# Altium schematic sheet esquematico_placa_micro.SchDoc
size A4; SheetNumber: 1; SheetTotal: 1
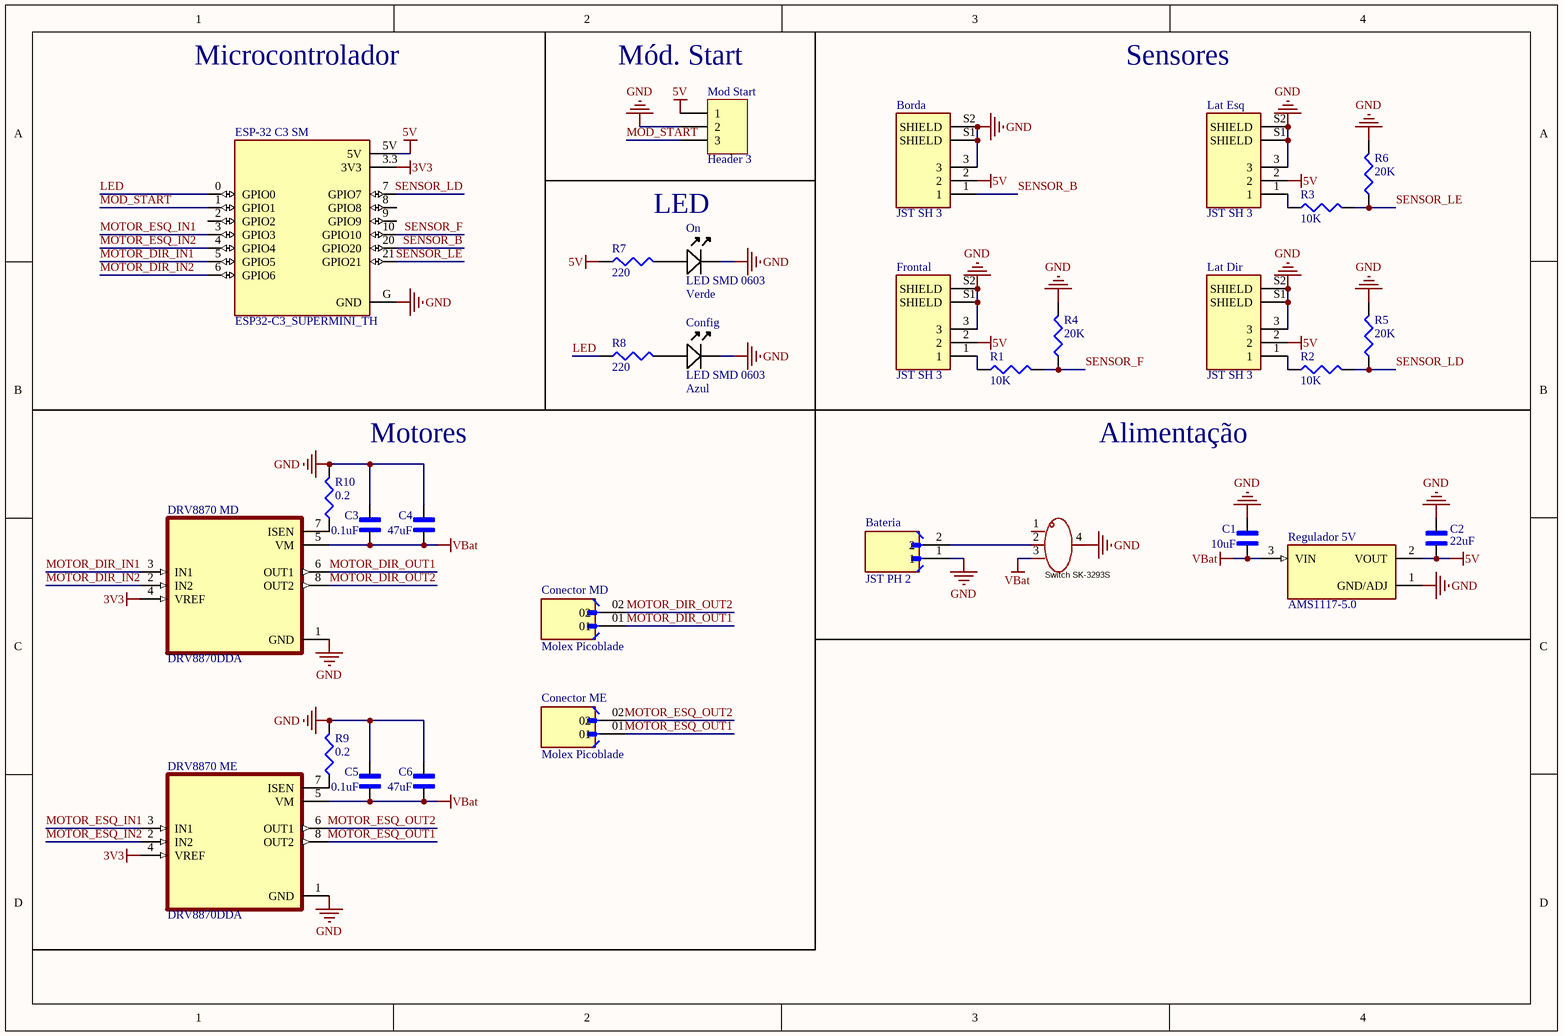
[diagram p0: esquematico_placa_micro.SchDoc]

## Parts
Bateria  JST PH 2  [JST_B2B-PH-K-S(LF)(SN)]
Borda  JST SH 3  [JST_BM03B-SRSS-TB(LF)(SN)]
C1  10uF  [CAPC0603]
C2  22uF  [CAPC0603]
C3  0.1uF  [CAPC0603]
C4  47uF  [CAPC0603]
C5  0.1uF  [CAPC0603]
C6  47uF  [CAPC0603]
Conector_MD  Molex Picoblade  [MOLEX_53047-0210]
Conector_ME  Molex Picoblade  [MOLEX_53047-0210]
Config  LED SMD 0603  Cor: Azul  [LED SMD 0603 Vermelho]
DRV8870_MD  DRV8870DDA  [VREG_LM5017MR/NOPB]
DRV8870_ME  DRV8870DDA  [VREG_LM5017MR/NOPB]
ESP-32_C3_SM  ESP32-C3_SUPERMINI_TH  [MODULE_ESP32-C3_SUPERMINI]
Frontal  JST SH 3  [JST_BM03B-SRSS-TB(LF)(SN)]
Lat_Dir  JST SH 3  [JST_BM03B-SRSS-TB(LF)(SN)]
Lat_Esq  JST SH 3  [JST_BM03B-SRSS-TB(LF)(SN)]
Mod_Start  Header 3  [MicroStart Start Module]
On  LED SMD 0603  Cor: Verde  [LED SMD 0603 Vermelho]
R1  value 10K  [Resistor SMD 0603]  (hidden comment: Resistor SMD)
R2  value 10K  [Resistor SMD 0603]  (hidden comment: Resistor SMD)
R3  value 10K  [Resistor SMD 0603]  (hidden comment: Resistor SMD)
R4  value 20K  [Resistor SMD 0603]  (hidden comment: Resistor SMD)
R5  value 20K  [Resistor SMD 0603]  (hidden comment: Resistor SMD)
R6  value 20K  [Resistor SMD 0603]  (hidden comment: Resistor SMD)
R7  value 220  [Resistor SMD 0603]  (hidden comment: Resistor SMD)
R8  value 220  [Resistor SMD 0603]  (hidden comment: Resistor SMD)
R9  value 0.2  [Resistor SMD 0603]  (hidden comment: Resistor SMD)
R10  value 0.2  [Resistor SMD 0603]  (hidden comment: Resistor SMD)
Regulador_5V  AMS1117-5.0  [AMS1117 5V]
Switch_SK-3293S  SK-3293S  [SW-SMD_SK-3293S]  (value not drawn)

## Nets
3V3: DRV8870_MD.4(VREF) DRV8870_ME.4(VREF) ESP-32_C3_SM.3.3(3V3)
5V: Borda.2 C2.1 ESP-32_C3_SM.5V Frontal.2 Lat_Dir.2 Lat_Esq.2 Mod_Start.1 R7.1 Regulador_5V.2(VOUT)
GND: Bateria.1 Borda.3 Borda.S1(SHIELD) Borda.S2(SHIELD) C1.2 C2.2 C3.2 C4.2 C5.2 C6.2 Config.K DRV8870_MD.1(GND) DRV8870_ME.1(GND) ESP-32_C3_SM.G(GND) Frontal.3 Frontal.S1(SHIELD) Frontal.S2(SHIELD) Lat_Dir.3 Lat_Dir.S1(SHIELD) Lat_Dir.S2(SHIELD) Lat_Esq.3 Lat_Esq.S1(SHIELD) Lat_Esq.S2(SHIELD) Mod_Start.2 On.K R4.2 R5.2 R6.2 R9.2 R10.2 Regulador_5V.1(GND/ADJ) Switch_SK-3293S.4(EH)
VBat: C1.1 C3.1 C4.1 C5.1 C6.1 DRV8870_MD.5(VM) DRV8870_ME.5(VM) Regulador_5V.3(VIN) Switch_SK-3293S.3
LED: ESP-32_C3_SM.0(GPIO0) R8.1
MOD_START: ESP-32_C3_SM.1(GPIO1) Mod_Start.3
MOTOR_DIR_IN1: DRV8870_MD.3(IN1) ESP-32_C3_SM.5(GPIO5)
MOTOR_DIR_IN2: DRV8870_MD.2(IN2) ESP-32_C3_SM.6(GPIO6)
MOTOR_DIR_OUT1: Conector_MD.01 DRV8870_MD.6(OUT1)
MOTOR_DIR_OUT2: Conector_MD.02 DRV8870_MD.8(OUT2)
MOTOR_ESQ_IN1: DRV8870_ME.3(IN1) ESP-32_C3_SM.3(GPIO3)
MOTOR_ESQ_IN2: DRV8870_ME.2(IN2) ESP-32_C3_SM.4(GPIO4)
MOTOR_ESQ_OUT1: Conector_ME.01 DRV8870_ME.8(OUT2)
MOTOR_ESQ_OUT2: Conector_ME.02 DRV8870_ME.6(OUT1)
SENSOR_B: Borda.1 ESP-32_C3_SM.20(GPIO20)
SENSOR_F: ESP-32_C3_SM.10(GPIO10) R1.2 R4.1
SENSOR_LD: ESP-32_C3_SM.7(GPIO7) R2.2 R5.1
SENSOR_LE: ESP-32_C3_SM.21(GPIO21) R3.2 R6.1
NetBateria_2: Bateria.2 Switch_SK-3293S.2
NetConfig_A: Config.A R8.2
NetDRV8870_MD_7: DRV8870_MD.7(ISEN) R10.1
NetDRV8870_ME_7: DRV8870_ME.7(ISEN) R9.1
NetFrontal_1: Frontal.1 R1.1
NetLat_Dir_1: Lat_Dir.1 R2.1
NetLat_Esq_1: Lat_Esq.1 R3.1
NetOn_A: On.A R7.2

Not connected (* = marked no-connect by the designer): ESP-32_C3_SM 2(GPIO2) 8(GPIO8) 9(GPIO9); Switch_SK-3293S 1

## Notes on the sheet
- Microcontrolador
- (near Mod_Start) Mód. Start
- Sensores
- LED
- Motores
- Alimentação

## Library data of the parts
Bateria = B2B-PH-K-S(LF)(SN): Connector Header Through Hole 2 position 0.079 (2.00mm); SnapEDA_Link: https://www.snapeda.com/parts/B2B-PH-K-S%20(LF)(SN)/JST/view-part/?ref=snap; Package: None; Value: *; MF: JST; MP: B2B-PH-K-S (LF)(SN); Check_prices: https://www.snapeda.com/parts/B2B-PH-K-S%20(LF)(SN)/JST/view-part/?ref=eda
Borda Frontal Lat_Dir Lat_Esq = BM03B-SRSS-TB(LF)(SN): Connector Header Surface Mount 3 position 0.039 (1.00mm); MF: JST Sales; SnapEDA_Link: https://www.snapeda.com/parts/BM03B-SRSS-TB(LF)(SN)/JST/view-part/?ref=snap; Package: None; Value: *; MP: BM03B-SRSS-TB(LF)(SN); Check_prices: https://www.snapeda.com/parts/BM03B-SRSS-TB(LF)(SN)/JST/view-part/?ref=eda
C1-C6 = Capacitor SMD: 0805 390 pF 50 V Â±5% Tolerance C0G SMT Multilayer Ceramic Capacitor; MF: Murata Electronics; MP: GRM2165C1H391JA01D; Price: 0.07 USD; SnapEDA_Link: https://www.snapeda.com/parts/GRM2165C1H391JA01D/Murata%2520Electronics%2520North%2520America/view-part/?ref=snap; Availability: Good; Package: 0805 Murata; Value: *
Conector_MD Conector_ME = 53047-0210: Picoblade Connector, 2 Circuit Single Row, Vertical Throughole PCB; MP: 0530470210; SnapEDA_Link: https://www.snapeda.com/parts/0530470210/Molex/view-part/?ref=snap; Package: None; Value: *; MF: Molex; Check_prices: https://www.snapeda.com/parts/0530470210/Molex/view-part/?ref=eda
Config On = LED SMD 0603: Diodo emissor de luz SMD 0603
ESP-32_C3_SM = ESP32-C3_SUPERMINI_TH: Super tiny ESP32-C3 board; MF: Espressif Systems; MP: ESP32-C3 SuperMini_TH; SnapEDA_Link: https://www.snapeda.com/parts/ESP32-C3%20SuperMini_TH/Espressif+Systems/view-part/?ref=snap; Package: Package; Value: *; Check_prices: https://www.snapeda.com/parts/ESP32-C3%20SuperMini_TH/Espressif+Systems/view-part/?ref=eda
Mod_Start = Header 3: Header, 3-Pin; LatestRevisionDate: 17-Jul-2002; LatestRevisionNote: Re-released for DXP Platform.; Publisher: Altium Limited
R1-R10 = Resistor SMD: Resistor SMD com os tamanhos 0603, 0805, 1206 e 1210; Size: 0603
Regulador_5V = AMS1117-5.0: 1A LOW DROPOUT VOLTAGE REGULATOR; MF: ams; MP: AMS1117-5.0; Package: SOT-223 Seeed Technology; SnapEDA_Link: https://www.snapeda.com/parts/AMS1117-5.0/ams/view-part/?ref=snap; Check_prices: https://www.snapeda.com/parts/AMS1117-5.0/ams/view-part/?ref=eda; Availability: Not in stock; Value: *; Price: None
Switch_SK-3293S = SK-3293S: Manufacturer: XKB Connectivity(中国星坤); Add into BOM: yes; Circuit: SPDT; Actuator Style: Rectangular columnar; Pin Style: SMDSplicing; Switch Length: 6mm; Switch Width: 2.75mm; Switch Height: 1.4mm; Actuator Color: White; Current Rating (DC): 50mA; Voltage Rating (DC): 12V; Mechanical Life: 1万次; Symbol: SK-3293S; Device: SK-3293S; LCSC Part Name: 柄长1.4mm 卧贴双档 滑动开关; Supplier Part: C466006; Manufacturer Part: SK-3293S; Supplier Footprint: SMD; JLCPCB Part Class: Extended Part; Datasheet: https://atta.szlcsc.com/upload/public/pdf/source/20211011/4EA3EA25F9F21B5CC9E3D39CE49F5B8E.pdf; Supplier: LCSC; Convert to PCB: yes; Mounting Style: 卧贴; Current Rating (AC): 50mA; Voltage Rating (AC): 12V; Operating Temperature: -40℃~+85℃
DRV8870_MD DRV8870_ME = DRV8870DDA: Package: None; Price: None; Value: *; MP: DRV8870DDA; Availability: Unavailable